# Altium schematic sheet Charger.SchDoc
size A4
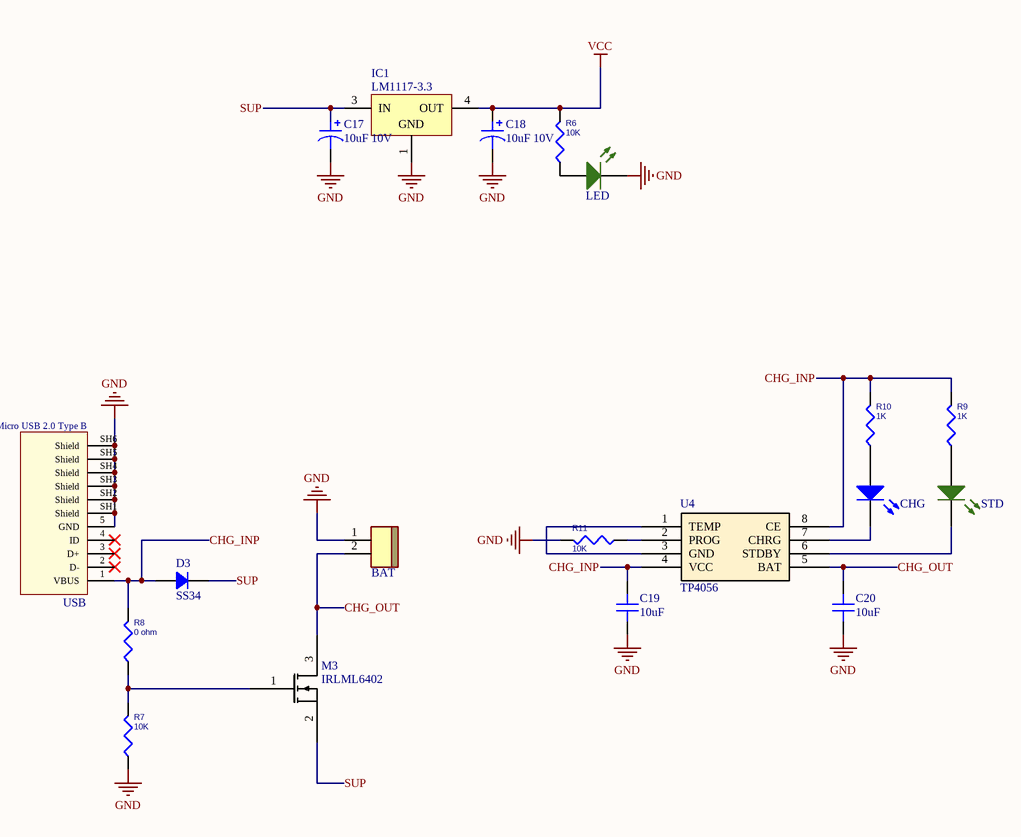
[diagram p0: Charger.SchDoc]

## Parts
BAT  JST BxB-PH-K 2Pin  [JST B2B-PH-K]  (value not drawn)
C17  10uF 10V  [CAP TANSMD 1206_3216 CASE A]
C18  10uF 10V  [CAP TANSMD 1206_3216 CASE A]
C19  10uF  [CAP 0603_1608]
C20  10uF  [CAP 0603_1608]
CHG  LED SMD 0603 BLUE  [LED_0603_RED]  (value not drawn)
D3  SS34  [DO-214AC SMA]
IC1  LM1117-3.3  [TD03B_N]
LED  LED SMD 0603 GREEN  [LED_0603_GREEN]  (value not drawn)
M3  IRLML6402  [SOT-23]
R6  10K  [0603R]
R7  10K  [0603R]
R8  0 ohm  [0603R]
R9  1K  [0603R]
R10  1K  [0603R]
R11  10K  [0603R]
STD  LED SMD 0603 GREEN  [LED_0603_GREEN]  (value not drawn)
U4  TP4056  [SOIC-8]
USB  Micro USB 2.0 Type B  [USB_MICRO_B_BM_SHT]

## Nets
GND: BAT.1 C17.2 C18.2 C19.2 C20.2 IC1.1(GND) LED.2(K) R7.1 R11.2 USB.5(GND) USB.SH1(Shield) USB.SH2(Shield) USB.SH3(Shield) USB.SH4(Shield) USB.SH5(Shield) USB.SH6(Shield)
VCC: C18.1 IC1.4(OUT) R6.2
CHG_INP: C19.1 D3.1 R8.2 R9.2 R10.2 U4.4(VCC) U4.8(CE) USB.1(VBUS)
CHG_OUT: BAT.2 C20.1 M3.3 U4.5(BAT)
SUP: C17.1 D3.2 IC1.3(IN) M3.2
NetCHG_1: CHG.1(A) R10.1
NetCHG_2: CHG.2(K) U4.7(CHRG)
NetLED_1: LED.1(A) R6.1
NetM3_1: M3.1 R7.2 R8.1
NetR9_1: R9.1 STD.1(A)
NetR11_1: R11.1 U4.2(PROG)
NetSTD_2: STD.2(K) U4.6(STDBY)
NetU4_1: U4.1(TEMP) U4.3(GND)

Not connected (* = marked no-connect by the designer): USB 2(D-)* 3(D+)* 4(ID)*

## Library data of the parts
BAT = JST BxB-PH-K 2Pin: Connector Header Through Hole 0.079" (2.00mm); PartNumber: B2B-PH-K-S(LF)(SN)
C17 C18 = Cap Tan Case A: SMT Tantalum Capacitor; VALUE: 10uF 10V
C19 C20 = Cap 0603: SMT Capacitor; VALUE: 10uF
D3 = US1M (SMD SMA): Diode Standard 1000V 1A Surface Mount SMA; PartNumber: SS34
IC1 = LM1117DT-x.x: x.x Volt, 800mA Low-Dropout Linear Regulator, 3-pin TO-252; PartNumber: LM1117DT-3.3; Manufacturer: National Semiconductor; PackageTopMarking: NSUZXYTT*LM1117*DT-X.X; PowerWise: N; CompType: LDO IC; DatasheetVersion: Apr-2006; PackageVersion: revD, Feb-2009; PackageReference: TD03B; PackageDescription: TO252, Molded, Jedec, 6.8 x 6.10 x 2.30mm Body, 3 Lead, 2.28mm Pitch, Surface Mount; Supplier 1: Farnell; Supplier 2: Farnell; RoHS: N; PinCount: 3; Code_JEDEC: TO-252-AA; ComponentLink1Description: LM1117 Datasheet; ComponentLink1URL: http://www.national.com/ds/LM/LM1117.pdf; ComponentLink2Description: LM1117 Web Page; ComponentLink2URL: http://www.national.com/pf/LM/LM1117.html; ComponentLink3Description: TD03B Package Page; ComponentLink3URL: http://www.national.com/packaging/folders/td03b.html
M3 = 2N7002A: Name: IRLML6402
R6-R11 = R
  R6 R7 R11: Value: 10K
  R8: Value: 0 ohm
  R9 R10: Value: 1K
USB = Micro USB 2.0 Type B Horizonta (SMD) UB-MC5BR3-SD204-4S-1-TB NMP: USB - micro B  Receptacle Connector 5 Position Surface Mount, Right Angle; PartNumber: UB-MC5BR3-SD204-4S-1-TB NMP